# EAGLE board project (EAGLE 6.3), part 1 of 2
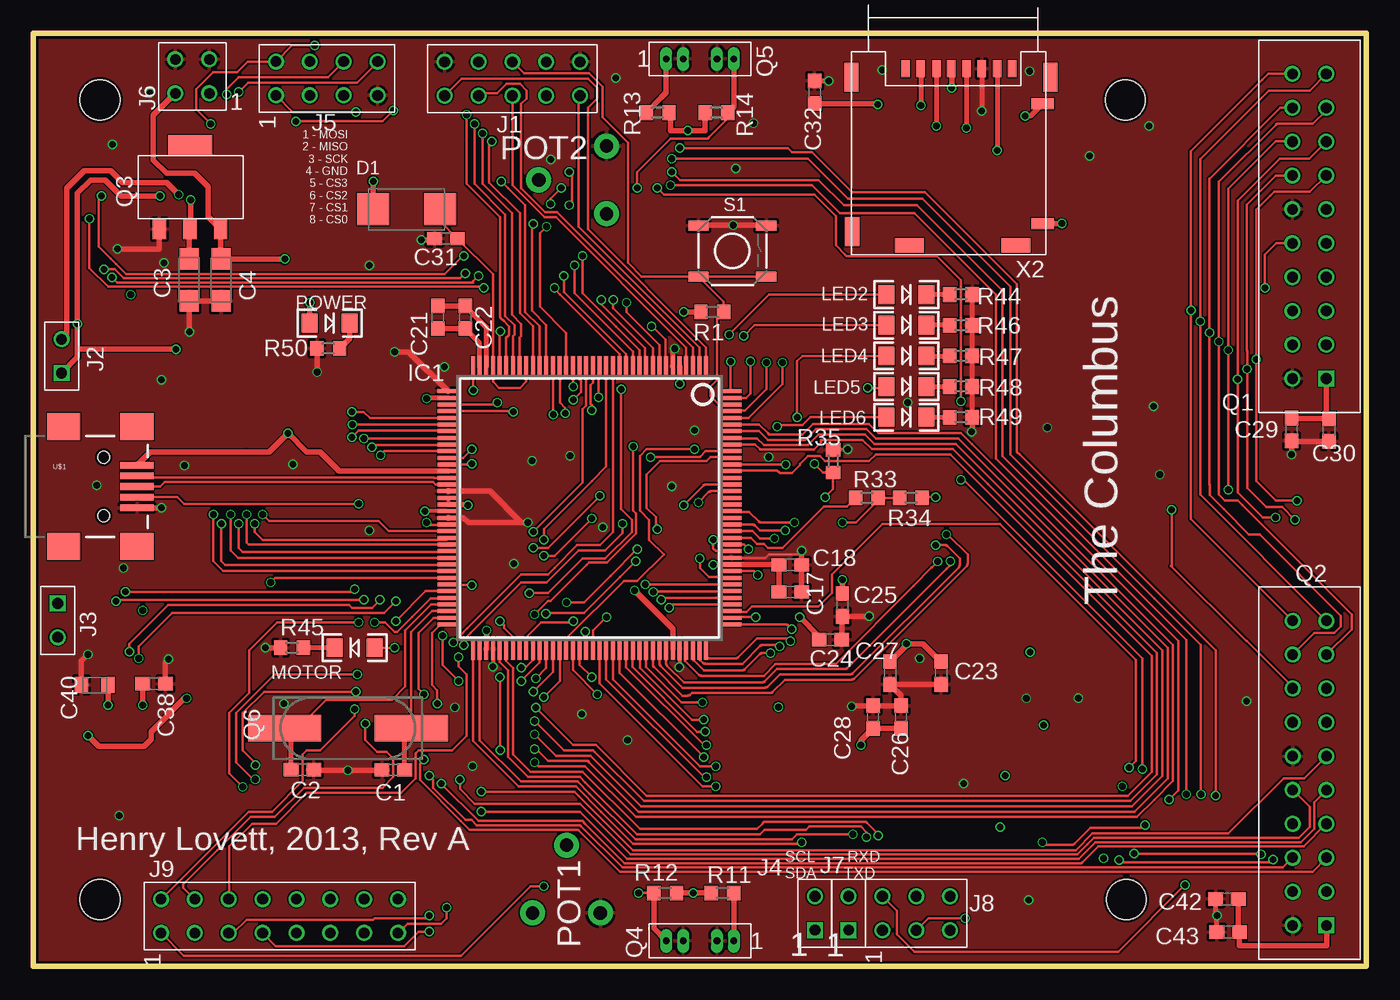
[diagram p6: board, top side]
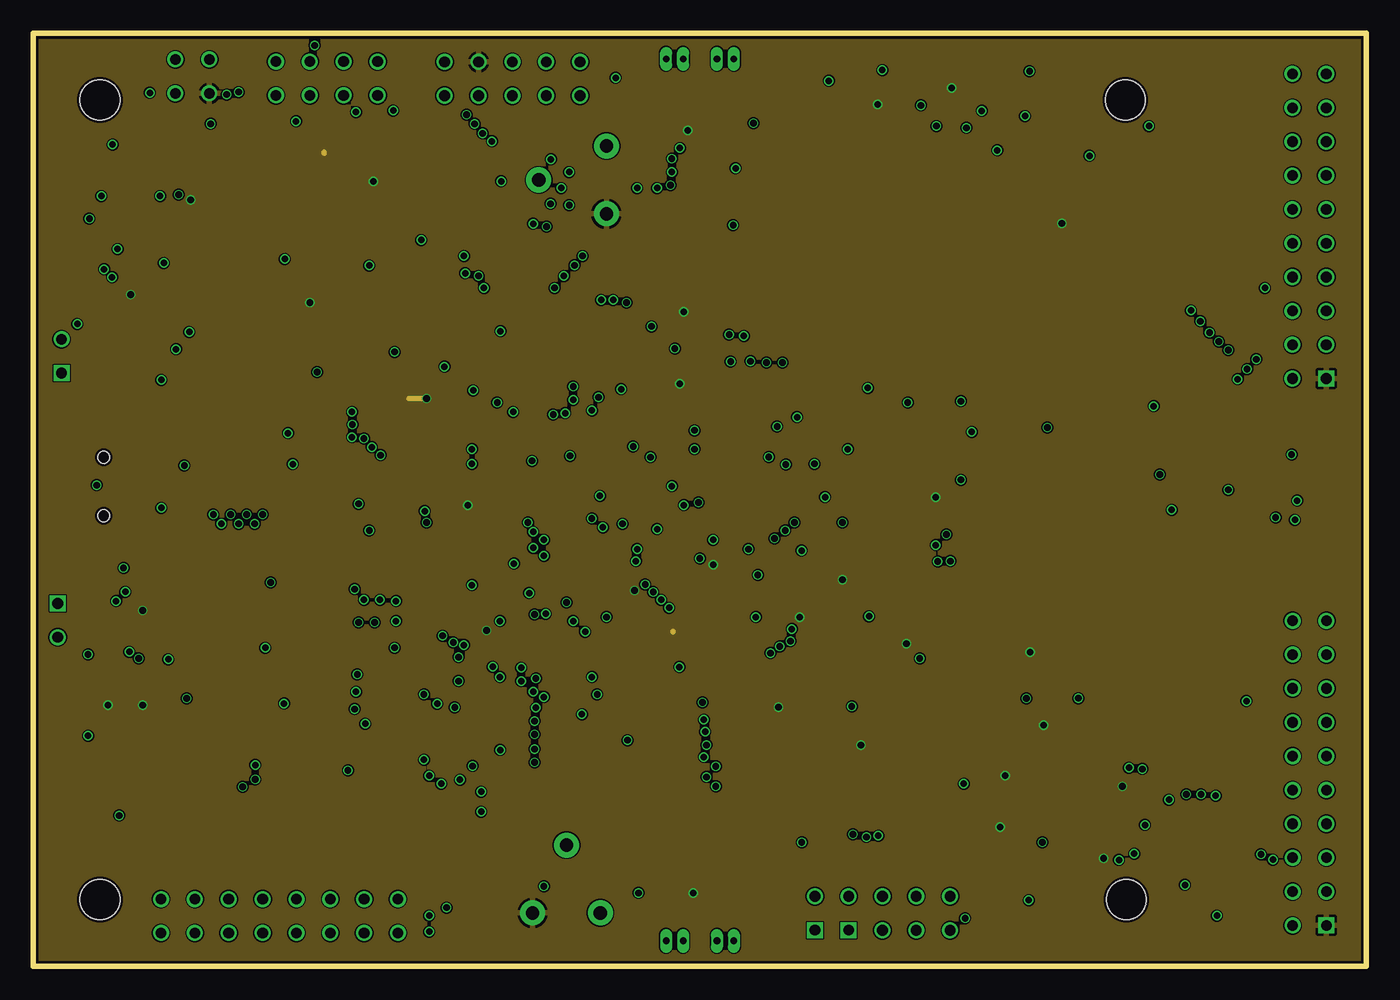
[diagram p7: board, inner layer 3V3]
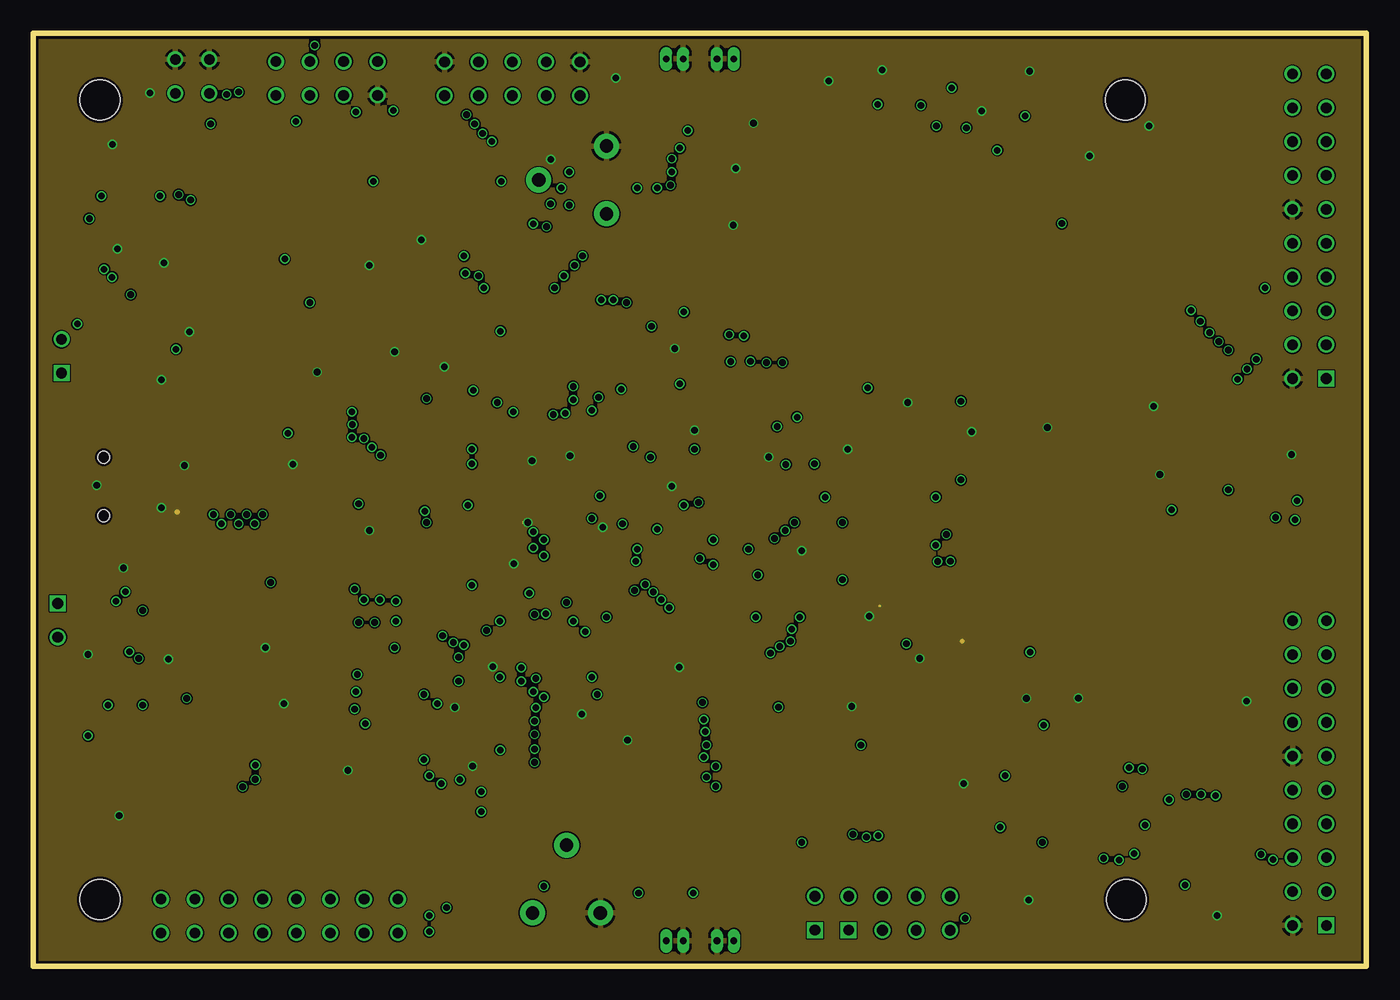
[diagram p8: board, inner layer GND]
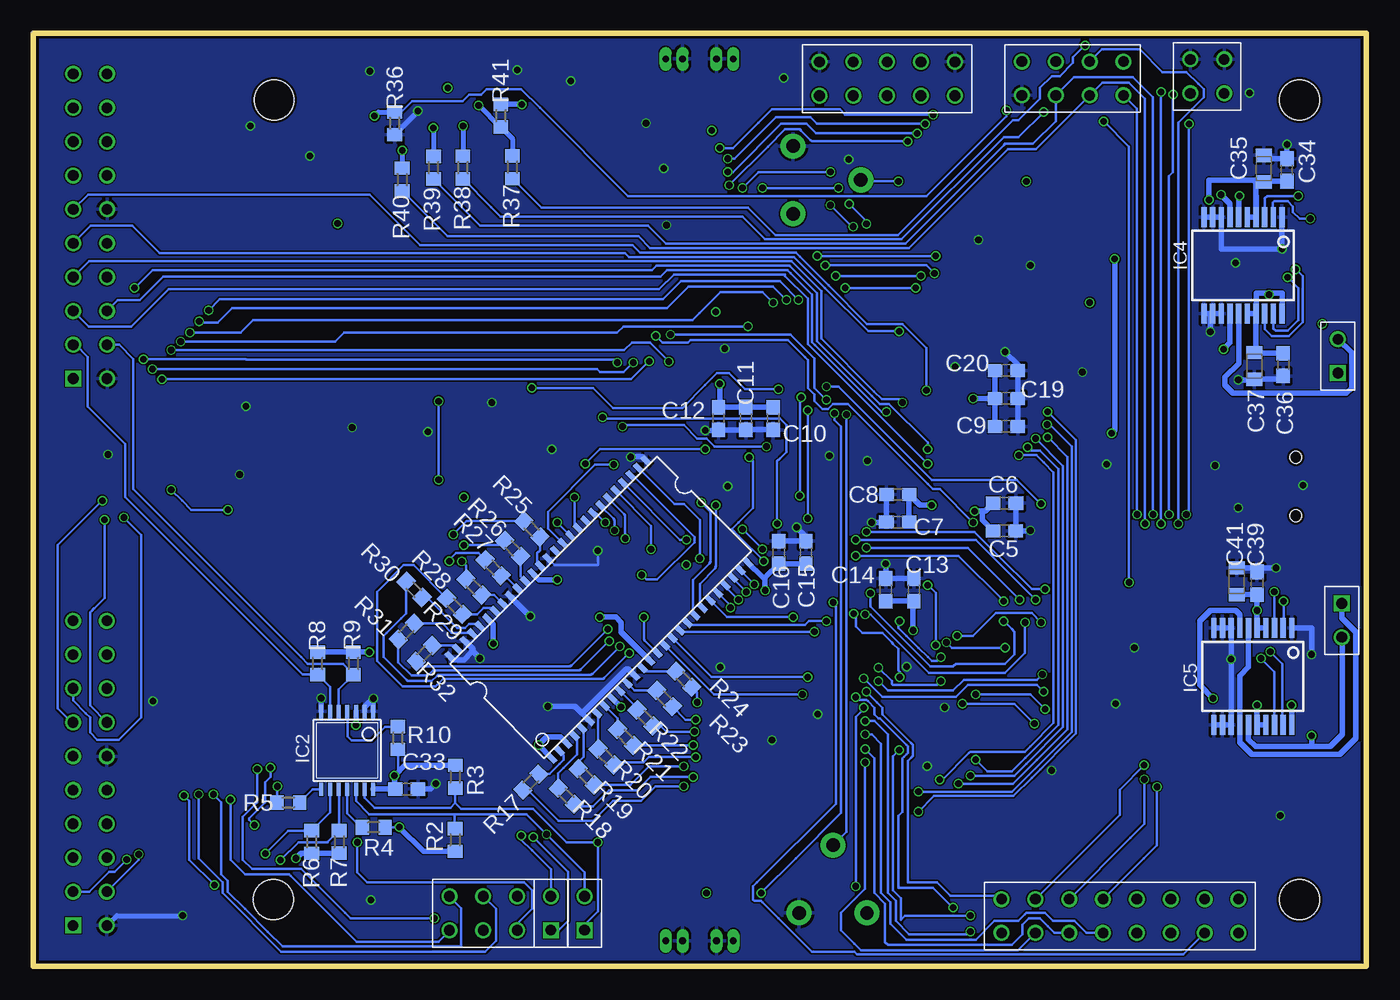
[diagram p9: board, bottom side, seen from below]

Size 100 x 70 mm. Coordinates in mm from the lower left corner, seen from the top.
Outline: 0,0 0,70 100,70 100,0 0,0
Copper layers (1*2+3*16): Top 0.035mm / dielectric 1.5mm / 3V3 0.035mm / dielectric 0.15mm / GND 0.035mm / dielectric 0.2mm / Bottom 0.035mm
Design rules "default": minimum track width 0.1mm, minimum drill 0.2mm, track to track 0.1mm, track to pad 0.1mm, pad to pad 0.1mm, via to via 0.1mm, smd to smd 0.1mm, copper to edge 0.2mm, drill to drill 0.2mm, minimum pad ring 0.2mm, minimum via ring 0.1mm, stop-mask expansion 0.075mm, vias tented up to drill 0mil, thermal gap 0.2mm
Holes 3 mm at 5,5 82,5 5,65 81.93,65.01

## Footprints (pad centres in the part's own frame; a part is rotated, then mirrored left to right if it is on the bottom)
C0603 = smd 1.1 x 1: 1 -0.85,0; 2 0.85,0
SMC_P = smd 1.6 x 1.4: + -1.575,0; - 1.575,0
SMC_Z = smd 1 x 1.2: + -1,0; - 1,0
SMC_C = smd 2.4 x 2.4: + -2.5,0; - 2.5,0
TQFP144 = smd 0.3 x 1.6: 1 -8.75,-10.6; 2 -8.25,-10.6; 3 -7.75,-10.6; 4 -7.25,-10.6; 5 -6.75,-10.6; 6 -6.25,-10.6; 7 -5.75,-10.6; 8 -5.25,-10.6; 9 -4.75,-10.6; 10 -4.25,-10.6; 11 -3.75,-10.6; 12 -3.25,-10.6; 13 -2.75,-10.6; 14 -2.25,-10.6; 15 -1.75,-10.6; 16 -1.25,-10.6; 17 -0.75,-10.6; 18 -0.25,-10.6; 19 0.25,-10.6; 20 0.75,-10.6; 21 1.25,-10.6; 22 1.75,-10.6; 23 2.25,-10.6; 24 2.75,-10.6; 25 3.25,-10.6; 26 3.75,-10.6; 27 4.25,-10.6; 28 4.75,-10.6; 29 5.25,-10.6; 30 5.75,-10.6; 31 6.25,-10.6; 32 6.75,-10.6; 33 7.25,-10.6; 34 7.75,-10.6; 35 8.25,-10.6; 36 8.75,-10.6; 73 8.75,10.6; 74 8.25,10.6; 75 7.75,10.6; 76 7.25,10.6; 77 6.75,10.6; 78 6.25,10.6; 79 5.75,10.6; 80 5.25,10.6; 81 4.75,10.6; 82 4.25,10.6; 83 3.75,10.6; 84 3.25,10.6; 85 2.75,10.6; 86 2.25,10.6; 87 1.75,10.6; 88 1.25,10.6; 89 0.75,10.6; 90 0.25,10.6; 91 -0.25,10.6; 92 -0.75,10.6; 93 -1.25,10.6; 94 -1.75,10.6; 95 -2.25,10.6; 96 -2.75,10.6; 97 -3.25,10.6; 98 -3.75,10.6; 99 -4.25,10.6; 100 -4.75,10.6; 101 -5.25,10.6; 102 -5.75,10.6; 103 -6.25,10.6; 104 -6.75,10.6; 105 -7.25,10.6; 106 -7.75,10.6; 107 -8.25,10.6; 108 -8.75,10.6 | smd 1.6 x 0.3: 37 10.6,-8.75; 38 10.6,-8.25; 39 10.6,-7.75; 40 10.6,-7.25; 41 10.6,-6.75; 42 10.6,-6.25; 43 10.6,-5.75; 44 10.6,-5.25; 45 10.6,-4.75; 46 10.6,-4.25; 47 10.6,-3.75; 48 10.6,-3.25; 49 10.6,-2.75; 50 10.6,-2.25; 51 10.6,-1.75; 52 10.6,-1.25; 53 10.6,-0.75; 54 10.6,-0.25; 55 10.6,0.25; 56 10.6,0.75; 57 10.6,1.25; 58 10.6,1.75; 59 10.6,2.25; 60 10.6,2.75; 61 10.6,3.25; 62 10.6,3.75; 63 10.6,4.25; 64 10.6,4.75; 65 10.6,5.25; 66 10.6,5.75; 67 10.6,6.25; 68 10.6,6.75; 69 10.6,7.25; 70 10.6,7.75; 71 10.6,8.25; 72 10.6,8.75; 109 -10.6,8.75; 110 -10.6,8.25; 111 -10.6,7.75; 112 -10.6,7.25; 113 -10.6,6.75; 114 -10.6,6.25; 115 -10.6,5.75; 116 -10.6,5.25; 117 -10.6,4.75; 118 -10.6,4.25; 119 -10.6,3.75; 120 -10.6,3.25; 121 -10.6,2.75; 122 -10.6,2.25; 123 -10.6,1.75; 124 -10.6,1.25; 125 -10.6,0.75; 126 -10.6,0.25; 127 -10.6,-0.25; 128 -10.6,-0.75; 129 -10.6,-1.25; 130 -10.6,-1.75; 131 -10.6,-2.25; 132 -10.6,-2.75; 133 -10.6,-3.25; 134 -10.6,-3.75; 135 -10.6,-4.25; 136 -10.6,-4.75; 137 -10.6,-5.25; 138 -10.6,-5.75; 139 -10.6,-6.25; 140 -10.6,-6.75; 141 -10.6,-7.25; 142 -10.6,-7.75; 143 -10.6,-8.25; 144 -10.6,-8.75
TSSOP14 = smd 0.305 x 0.991: 1 -1.95,-2.918; 2 -1.3,-2.918; 3 -0.65,-2.918; 4 0,-2.918; 5 0.65,-2.918; 6 1.3,-2.918; 7 1.95,-2.918; 8 1.95,2.918; 9 1.3,2.918; 10 0.65,2.918; 11 0,2.918; 12 -0.65,2.918; 13 -1.3,2.918; 14 -1.95,2.918
TSOP54 = smd 0.813 x 0.406: 1 -5.4,9.6; 2 -5.4,8.8; 3 -5.4,8; 4 -5.4,7.2; 5 -5.4,6.4; 6 -5.4,5.6; 7 -5.4,4.8; 8 -5.4,4; 9 -5.4,3.2; 10 -5.4,2.4; 11 -5.4,1.6; 12 -5.4,0.8; 13 -5.4,0; 14 -5.4,-0.8; 15 -5.4,-1.6; 16 -5.4,-2.4; 17 -5.4,-3.2; 18 -5.4,-4; 19 -5.4,-4.8; 20 -5.4,-5.6; 21 -5.4,-6.4; 22 -5.4,-7.2; 23 -5.4,-8; 24 -5.4,-8.8; 25 -5.4,-9.6; 26 -5.4,-10.4; 27 -5.4,-11.2; 28 5.4,-11.2; 29 5.4,-10.4; 30 5.4,-9.6; 31 5.4,-8.8; 32 5.4,-8; 33 5.4,-7.2; 34 5.4,-6.4; 35 5.4,-5.6; 36 5.4,-4.8; 37 5.4,-4; 38 5.4,-3.2; 39 5.4,-2.4; 40 5.4,-1.6; 41 5.4,-0.8; 42 5.4,0; 43 5.4,0.8; 44 5.4,1.6; 45 5.4,2.4; 46 5.4,3.2; 47 5.4,4; 48 5.4,4.8; 49 5.4,5.6; 50 5.4,6.4; 51 5.4,7.2; 52 5.4,8; 53 5.4,8.8; 54 5.4,9.6
SSOP20 = smd 0.4 x 1.5: 1 -2.925,-3.625; 2 -2.275,-3.625; 3 -1.625,-3.625; 4 -0.975,-3.625; 5 -0.325,-3.625; 6 0.325,-3.625; 7 0.975,-3.625; 8 1.625,-3.625; 9 2.275,-3.625; 10 2.925,-3.625; 11 2.925,3.625; 12 2.275,3.625; 13 1.625,3.625; 14 0.975,3.625; 15 0.325,3.625; 16 -0.325,3.625; 17 -0.975,3.625; 18 -1.625,3.625; 19 -2.275,3.625; 20 -2.925,3.625
2.54MM2X5TH = drill 0.8: 1 0,0; 2 0,2.54; 3 2.54,0; 4 2.54,2.54; 5 5.08,0; 6 5.08,2.54; 7 7.62,0; 8 7.62,2.54; 9 10.16,0; 10 10.16,2.54
1BY2 = drill 0.8 square: 1 0,1.27 | drill 0.8: 2 0,-1.27
2.54MM2X4TH = drill 0.8: 1 0,0; 2 2.54,0; 3 5.08,0; 4 7.62,0; 5 7.62,2.54; 6 5.08,2.54; 7 2.54,2.54; 8 0,2.54
2.54MM2X2TH = drill 0.8: 1 0,0; 2 2.54,0; 3 2.54,2.54; 4 0,2.54
2.54MM2X3TH = drill 0.8: 1 0,0; 2 2.54,0; 3 5.08,0; 4 5.08,2.54; 5 2.54,2.54; 6 0,2.54
2.54MM2X8TH = drill 0.8: 1 0,0; 2 2.54,0; 3 5.08,0; 4 7.62,0; 5 10.16,0; 6 12.7,0; 7 15.24,0; 8 17.78,0; 9 17.78,2.54; 10 15.24,2.54; 11 12.7,2.54; 12 10.16,2.54; 13 7.62,2.54; 14 5.08,2.54; 15 2.54,2.54; 16 0,2.54
LED-1206 = smd 1.2 x 1.4: A -1.5,0; C 1.5,0
OV7670 = drill 0.8 square: 3V3 0,0 | drill 0.8: D0 0,-15.24; D1 2.54,-15.24; D2 0,-17.78; D3 2.54,-17.78; D4 0,-20.32; D5 2.54,-20.32; D6 0,-22.86; D7 2.54,-22.86; GND 2.54,0; GND2 2.54,-12.7; NOE 2.54,-10.16; RCLK 0,-12.7; RRST 0,-10.16; SCL 0,-2.54; SDA 2.54,-2.54; VSYNC 0,-5.08; WEN 0,-7.62; WRST 2.54,-5.08; XCLK 2.54,-7.62
SOT-223 = smd 1 x 1.5: 1 -2.3,-3; 2 0,-3; 3 2.3,-3 | smd 3.3 x 1.5: PAD 0,3.3
TCRT1010 = drill 0.5 long: ANODE 0,0; CATHODE 1.27,0; COLLECTOR 5.08,0; EMMITTER 3.81,0
CSM-7X-DU = smd 5.5 x 2: 1 -4.75,0; 2 4.75,0
R0603 = smd 1 x 1.1: 1 -0.85,0; 2 0.85,0
TRIM_POT = drill 1 pad 1.88: 1 5.08,0; 2 0,2.54; 3 0,-2.54
TACTILE_SWITCH_SMD = smd 1.524 x 0.762: 1 -2.54,1.905; 2 2.54,1.905; 3 -2.54,-1.905; 4 2.54,-1.905
USB-MINIB = smd 2.5 x 0.5: D+ 2.5,0; D- 2.5,0.8; GND 2.5,-1.6; ID 2.5,-0.8; VBUS 2.5,1.6 | smd 2.5 x 2: MTN1 -3,4.5; MTN2 2.5,4.5; MTN3 -3,-4.5; MTN4 2.5,-4.5 | hole 0.9: 0,2.2; 0,-2.2
MICROSD = smd 0.635 x 1.27: 1 -2.413,6.35; 2 -1.232,6.337; 4 -0.127,6.35; 5 1.016,6.35; 6 2.159,6.35; 7 3.302,6.35; 8 4.445,6.35; 9 -3.556,6.35 | smd 1.676 x 0.813: CD 6.73,3.715; SW 6.73,-5.285 | smd 1.067 x 2.184: M1 7.303,5.715; M4 -7.57,-5.885; M5 -7.62,5.715 | smd 2.184 x 1.067: M2 4.73,-6.92; M3 -3.27,-6.92

## Placement (x,y rotation side)
C1  22pF  [C0603]  27,14.74 180 top
C2  22pF  [C0603]  20.19,14.74 0 top
C3  10uF  [SMC_P]  11.69,51.49 270 top
C4  10uF  [SMC_P]  14.09,51.49 270 top
C5  2.2u  [C0603]  27.14,32.66 0 bottom
C6  1n  [C0603]  27.13,34.74 0 bottom
C7  100n  [C0603]  35.14,33.33 180 bottom
C8  4.7u  [C0603]  35.13,35.4 180 bottom
C9  33n  [C0603]  27,40.5 0 bottom
C10  4.7u  [C0603]  44.5,41.1 270 bottom
C11  33n  [C0603]  46.54,41.11 270 bottom
C12  100n  [C0603]  48.6,41.1 270 bottom
C13  33n  [C0603]  33.93,28.24 90 bottom
C14  100n  [C0603]  36.04,28.24 90 bottom
C15  33n  [C0603]  42.03,31.04 90 bottom
C16  100n  [C0603]  44.07,31.04 90 bottom
C17  33n  [C0603]  56.79,28.08 0 top
C18  100n  [C0603]  56.79,30.11 0 top
C19  100n  [C0603]  27,42.6 0 bottom
C20  33n  [C0603]  27,44.7 0 bottom
C21  100n  [C0603]  30.34,48.7 270 top
C22  33n  [C0603]  32.4,48.7 270 top
C23  4.7u  [C0603]  68.1,22 270 top
C24  100n  [C0603]  59.8,24.5 0 top
C25  33n  [C0603]  60.7,27.1 270 top
C26  4.7u  [C0603]  65.1,18.7 90 top
C27  100n  [C0603]  64.27,22 270 top
C28  33n  [C0603]  63,18.7 90 top
C29  100n  [C0603]  94.4,40.28 270 top
C30  33n  [C0603]  97.2,40.23 270 top
C31  100n  [C0603]  30.95,54.6 180 top
C32  100n  [C0603]  58.62,65.58 90 top
C33  100n  [C0603]  71.99,13.29 0 bottom
C34  0.1u  [C0603]  5.95,59.75 90 bottom
C35  10u  [SMC_Z]  7.68,59.85 90 bottom
C36  0.1u  [C0603]  6.23,45.14 270 bottom
C37  10u  [SMC_Z]  8.4,45.04 270 bottom
C38  0.1u  [C0603]  9.05,21.2 0 top
C39  0.1u  [C0603]  8.19,28.73 90 bottom
C40  10u  [SMC_Z]  4.6,21.1 180 top
C41  10u  [SMC_Z]  9.72,28.88 90 bottom
C42  100n  [C0603]  89.55,5.05 180 top
C43  33n  [C0603]  89.64,2.56 180 top
D1  DIODESMD  [SMC_C]  28,56.8 0 top
IC1  UC3C  [TQFP144]  41.73,34.39 180 top
IC2  PCA9542A  [TSSOP14]  76.44,16.19 180 bottom
IC3  MT48LC4M16A2TSOP54  [TSOP54]  58.14,26.2 135 bottom
IC4  TB6593FNGSSOP20  [SSOP20]  9.24,52.58 180 bottom
IC5  TB6593FNGSSOP20  [SSOP20]  8.51,21.74 180 bottom
J1  JTAG2.54MM2X5TH  [2.54MM2X5TH]  30.86,65.32 0 top
J2  1BY2THROUGHHOLE  [1BY2]  2.12,45.78 180 top
J3  1BY2THROUGHHOLE  [1BY2]  1.83,25.95 0 top
J4  1BY2THROUGHHOLE  [1BY2]  58.64,3.97 180 top
J5  8PIN2.54MM2X4TH  [2.54MM2X4TH]  18.21,65.34 0 top
J6  4PIN2.54MM2X2TH  [2.54MM2X2TH]  13.2,65.5 90 top
J7  1BY2THROUGHHOLE  [1BY2]  61.17,3.97 180 top
J8  6PIN2.54MM2X3TH  [2.54MM2X3TH]  63.7,2.7 0 top
J9  16PIN2.54MM2X8TH  [2.54MM2X8TH]  9.58,2.49 0 top
LED2  [LED-1206]  65.5,50.4 0 top
LED3  [LED-1206]  65.5,48.1 0 top
LED4  [LED-1206]  65.5,45.8 0 top
LED5  [LED-1206]  65.5,43.5 0 top
LED6  [LED-1206]  65.5,41.2 0 top
MOTOR  [LED-1206]  24.1,23.9 180 top
POWER  [LED-1206]  22.23,48.26 0 top
Q1  OV7670  [OV7670]  97.01,44.09 180 top
Q2  OV7670  [OV7670]  97.02,3.06 180 top
Q3  VREGSOT-223  [SOT-223]  11.75,58.31 0 top
Q4  TCRT1010TH  [TCRT1010]  52.56,1.9 180 top
Q5  TCRT1010TH  [TCRT1010]  47.48,68.08 0 top
Q6  CSM-7X-DU  [CSM-7X-DU]  23.6,17.86 0 top
R1  10k  [R0603]  50.95,49.09 180 top
R2  4k7  [R0603]  68.35,9.47 90 bottom
R3  4k7  [R0603]  68.34,14.22 270 bottom
R4  4k7  [R0603]  74.45,10.42 180 bottom
R5  4k7  [R0603]  80.86,12.28 0 bottom
R6  4k7  [R0603]  79.12,9.32 90 bottom
R7  4k7  [R0603]  77.05,9.33 90 bottom
R8  4k7  [R0603]  78.67,22.72 270 bottom
R9  4k7  [R0603]  75.98,22.72 270 bottom
R10  4k7  [R0603]  72.65,17.12 90 bottom
R11  150  [R0603]  51.7,5.5 180 top
R12  10k  [R0603]  47.4,5.5 0 top
R13  150  [R0603]  46.84,64.05 0 top
R14  10k  [R0603]  51.25,64.05 180 top
R15  [TRIM_POT]  40,4 90 top
R16  [TRIM_POT]  43,59 180 top
R17  68R  [R0603]  62.68,13.82 225 bottom
R18  68R  [R0603]  60.01,12.76 315 bottom
R19  68R  [R0603]  58.52,14.22 315 bottom
R20  68R  [R0603]  57.03,15.7 315 bottom
R21  68R  [R0603]  55.58,17.18 315 bottom
R22  68R  [R0603]  54.1,18.63 315 bottom
R23  68R  [R0603]  52.65,20.08 315 bottom
R24  68R  [R0603]  51.2,21.53 315 bottom
R25  68R  [R0603]  62.6,32.8 135 bottom
R26  68R  [R0603]  64.05,31.35 135 bottom
R27  68R  [R0603]  65.5,29.91 135 bottom
R28  68R  [R0603]  66.94,28.46 135 bottom
R29  68R  [R0603]  68.39,27.01 135 bottom
R30  68R  [R0603]  71.44,28.26 135 bottom
R31  68R  [R0603]  72.01,25.11 225 bottom
R32  68R  [R0603]  70.66,23.46 225 bottom
R33  68R  [R0603]  62.54,35.15 0 top
R34  4k7  [R0603]  65.85,35.15 180 top
R35  4k7  [R0603]  60,37.9 270 top
R36  100k  [R0603]  72.89,63.24 270 bottom
R37  68R  [R0603]  64.06,59.95 90 bottom
R38  68R  [R0603]  67.77,59.93 90 bottom
R39  68R  [R0603]  69.97,59.92 90 bottom
R40  68R  [R0603]  72.33,59.03 90 bottom
R41  100k  [R0603]  64.92,63.82 270 bottom
R44  330R  [R0603]  69.6,50.4 180 top
R45  330R  [R0603]  19.4,23.9 0 top
R46  330R  [R0603]  69.6,48.1 180 top
R47  330R  [R0603]  69.6,45.8 180 top
R48  330R  [R0603]  69.6,43.5 180 top
R49  330R  [R0603]  69.6,41.2 180 top
R50  330R  [R0603]  22.13,46.35 0 top
S1  [TACTILE_SWITCH_SMD]  52.45,53.66 0 top
U$1  USB-MINIB-5PIN  [USB-MINIB]  5.28,36 0 top
X2  MICROSDSMD  [MICROSD]  69,61 0 top